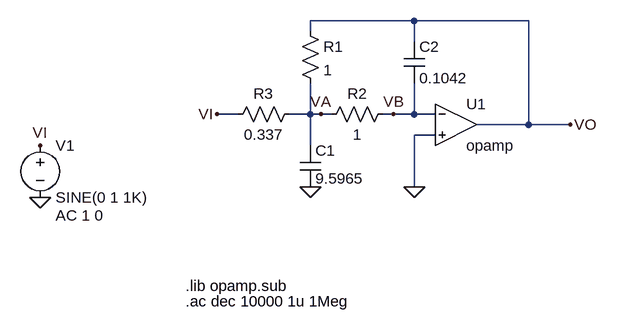
[diagram p0: schematic multiple_fb_normalizado.asc]
multiple_fb_normalizado.asc, the LTspice schematic file:
Version 4.1
SHEET 1 880 680
WIRE 208 -64 48 -64
WIRE 384 -64 208 -64
WIRE 48 -48 48 -64
WIRE 208 -32 208 -64
WIRE -64 80 -96 80
WIRE 48 80 48 32
WIRE 48 80 16 80
WIRE 64 80 48 80
WIRE 80 80 64 80
WIRE 176 80 160 80
WIRE 208 80 208 32
WIRE 208 80 176 80
WIRE 240 80 208 80
WIRE 384 96 384 -64
WIRE 384 96 304 96
WIRE 448 96 384 96
WIRE 240 112 208 112
WIRE 48 128 48 80
WIRE 208 192 208 112
FLAG 208 192 0
FLAG -96 80 VI
FLAG 448 96 VO
FLAG -368 208 0
FLAG -368 128 VI
FLAG 48 192 0
FLAG 64 80 VA
FLAG 176 80 VB
SYMBOL OpAmps\\opamp 272 32 R0
SYMATTR InstName U1
SYMBOL res 176 64 R90
WINDOW 0 0 56 VBottom 2
WINDOW 3 32 56 VTop 2
SYMATTR InstName R2
SYMATTR Value 1
SYMBOL cap 32 128 R0
WINDOW 3 24 51 Left 2
SYMATTR InstName C1
SYMATTR Value 9.5965
SYMBOL res 32 -64 R0
SYMATTR InstName R1
SYMATTR Value 1
SYMBOL res 32 64 R90
WINDOW 0 0 56 VBottom 2
WINDOW 3 32 56 VTop 2
SYMATTR InstName R3
SYMATTR Value 0.337
SYMBOL cap 192 -32 R0
SYMATTR InstName C2
SYMATTR Value 0.1042
SYMBOL voltage -368 112 R0
WINDOW 123 24 124 Left 2
WINDOW 39 0 0 Left 0
SYMATTR Value2 AC 1 0
SYMATTR InstName V1
SYMATTR Value SINE(0 1 1K)
TEXT -144 344 Left 2 !.lib opamp.sub
TEXT -144 368 Left 2 !.ac dec 10000 1u 1Meg

The netlist it stands for:
* multiple_fb_normalizado.asc
X§U1 VB 0 VO opamp Aol=100K GBW=10Meg  ; pins invin noninvin out
R2 VB VA 1
C1 VA 0 9.5965
R1 VO VA 1
R3 VA VI 0.337
C2 VO VB 0.1042
V1 VI 0 SINE(0 1 1K) AC 1 0
.lib opamp.sub
.ac dec 10000 1u 1Meg
.backanno
.end